# EAGLE design PhotodiodeSplitter2.0 (EAGLE 5.10)
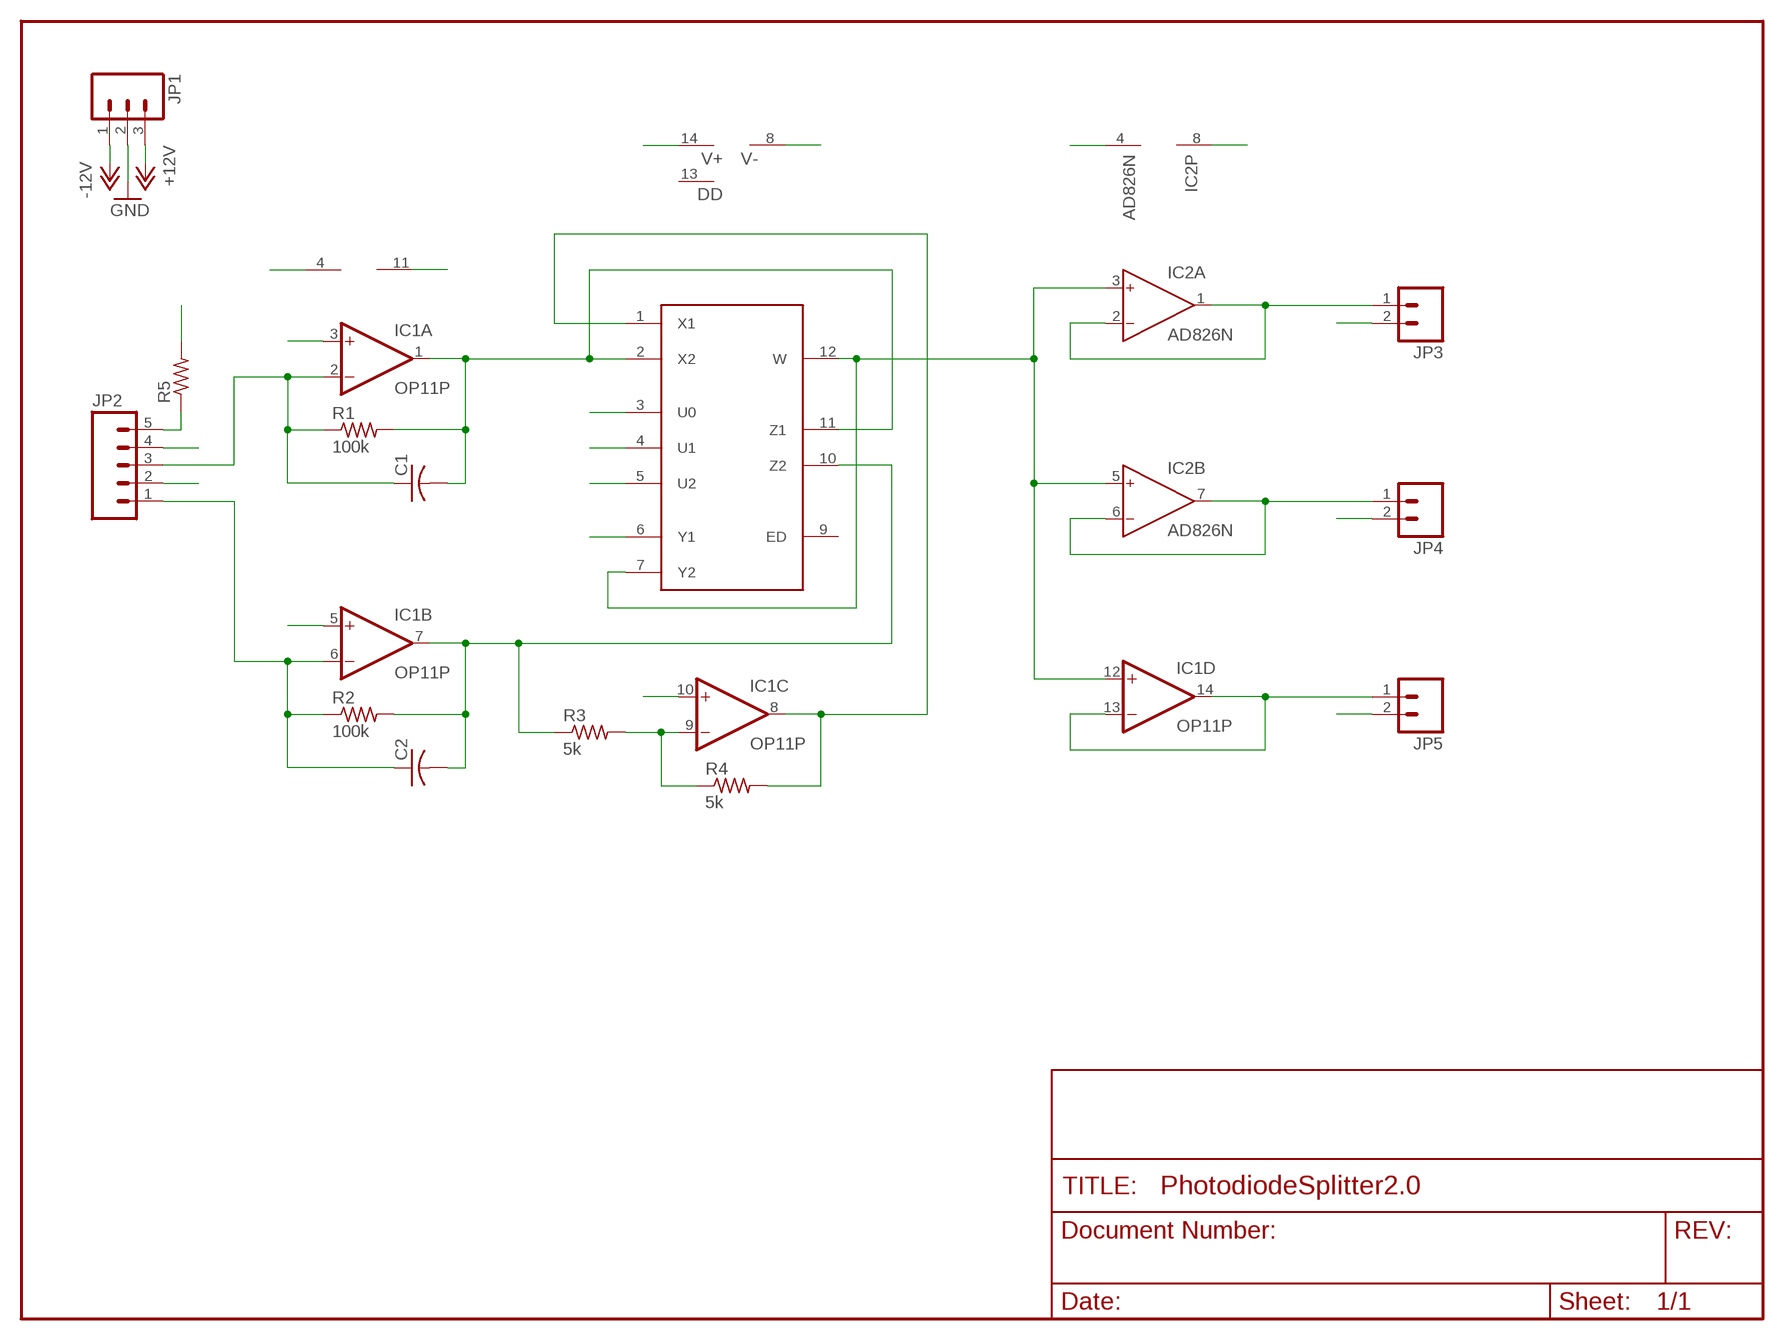
[diagram p0: schematic, sheet 1]

## Parts
C1  C-US050-025X075  [C050-025X075]
C2  C-US050-025X075  [C050-025X075]
IC1  OP11P  [DIL14]
IC2  AD826N  [DIL08]
JP1  M03PTH  [1X03]
JP2  M05PTH  [1X05]
JP3  M02PTH  [1X02]
JP4  M02PTH  [1X02]
JP5  M02PTH  [1X02]
MP1  AD734AQ  [DIL14]
R1  100k  R-US_0207/10  [0207/10]
R2  100k  R-US_0207/10  [0207/10]
R3  5k  R-US_0207/10  [0207/10]
R4  5k  R-US_0207/10  [0207/10]
R5  R-US_0309/12  [0309/12]

## Nets
+12V: IC1.4(P:V+) IC2.8(P:V+) JP1.3 MP1.14(V+) R5.2
-12V: IC1.11(P:V-) IC2.4(P:V-) JP1.1 MP1.8(V-)
GND: IC1.3(A:+IN) IC1.5(B:+IN) IC1.10(C:+IN) JP1.2 JP2.2 JP2.4 JP3.2 JP4.2 JP5.2 MP1.3(U0) MP1.4(U1) MP1.5(U2) MP1.6(Y1)
N$1: C1.1 IC1.2(A:-IN) JP2.3 R1.1
N$2: C1.2 IC1.1(A:OUT) MP1.2(X2) MP1.11(Z1) R1.2
N$3: C2.1 IC1.6(B:-IN) JP2.1 R2.1
N$4: C2.2 IC1.7(B:OUT) MP1.10(Z2) R2.2 R3.1
N$5: IC1.9(C:-IN) R3.2 R4.1
N$6: IC1.8(C:OUT) MP1.1(X1) R4.2
N$7: IC1.12(D:+IN) IC2.3(A:IN+) IC2.5(B:IN+) MP1.7(Y2) MP1.12(W)
N$8: IC2.1(A:OUT) IC2.2(A:IN-) JP3.1
N$9: IC2.6(B:IN-) IC2.7(B:OUT) JP4.1
N$10: IC1.13(D:-IN) IC1.14(D:OUT) JP5.1
N$11: JP2.5 R5.1
Unconnected: MP1.9(ED) MP1.13(DD)

## Library data of the parts
C1 C2 = resistor:C-US: CAPACITOR, American symbol
IC1 = linear:OP11: Quad Low-Offset Low-Power OP AMP The OP-11 is pin compatible with the OP-400 , LM148, HA4741, RM4156, and LT1014 operational amplifiers source http://products.analog.com/products/info.asp?product=OP400
IC2 = analog-devices:AD826: High-Speed, Low-Power Dual Operational Amplifier Source: http://www.analog.com/static/imported-files/data_sheets/AD826.pdf
JP1 = SparkFun:M03: Header 3 Standard 3-pin 0.1" header. Use with straight break away headers (SKU : PRT-00116), right angle break away headers (PRT-00553), swiss pins (PRT-00743), machine pins (PRT-00117), and female headers (PRT-00115). Molex polarized connector foot print use with SKU : PRT-08232 with associated crimp pins and housings.
JP2 = SparkFun:M05: Header 5 Standard 5-pin 0.1" header. Use with straight break away headers (SKU : PRT-00116), right angle break away headers (PRT-00553), swiss pins (PRT-00743), machine pins (PRT-00117), and female headers (PRT-00115). Molex polarized connector foot print use with SKU : PRT-08230 with associated crimp pins and housings.
JP3-JP5 = SparkFun:M02: Header 2 Standard 2-pin 0.1" header. Use with straight break away headers (SKU : PRT-00116), right angle break away headers (PRT-00553), swiss pins (PRT-00743), machine pins (PRT-00117), and female headers (PRT-00115). Molex polarized connector foot print use with SKU : PRT-08233 with associated crimp pins and housings.
MP1 = ad734:AD734*: 10 MHz, 4-Quadrant Multiplier/Divider FEATURES High Accuracy 0.1% Typical Error High Speed 10 MHz Full-Power Bandwidth 450 V/µs Slew Rate 200 ns Settling to 0.1% at Full Power Low Distortion -80 dBc from Any Input Third-Order IMD Typically -75 dBc at 10 MHz Low Noise 94 dB SNR, 10 Hz to 20 kHz 70 dB SNR, 10 Hz to 10 MHz Direct Division Mode 2 MHz BW at Gain of 100 APPLICATIONS High Performance Replacement for AD534 Multiply, Divide, Square, Square Root Modulator, Demodulator Wideband Gain Control, RMS-DC Conversion Voltage-Controlled Amplifiers, Oscillators, and Filters Demodulator with 40 MHz Input Bandwidth The AD734 is an accurate high speed, four-quadrant analog multiplier that is pin-compatible with the industry-standard AD534 and provides the transfer function W=XY/U. The AD734 provides a low-impedance voltage output with a fullpower (20V pk-pk) bandwidth of 10MHz. Total static error (scaling, offsets, and nonlinearities combined) is 0.1% of full scale. Distortion is typically less than -80dBc and guaranteed. The low capacitance X, Y and Z inputs are fully differential. In most applications, no external components are required to define the function.
R1-R5 = resistor:R-US_: RESISTOR, American symbol

## Board
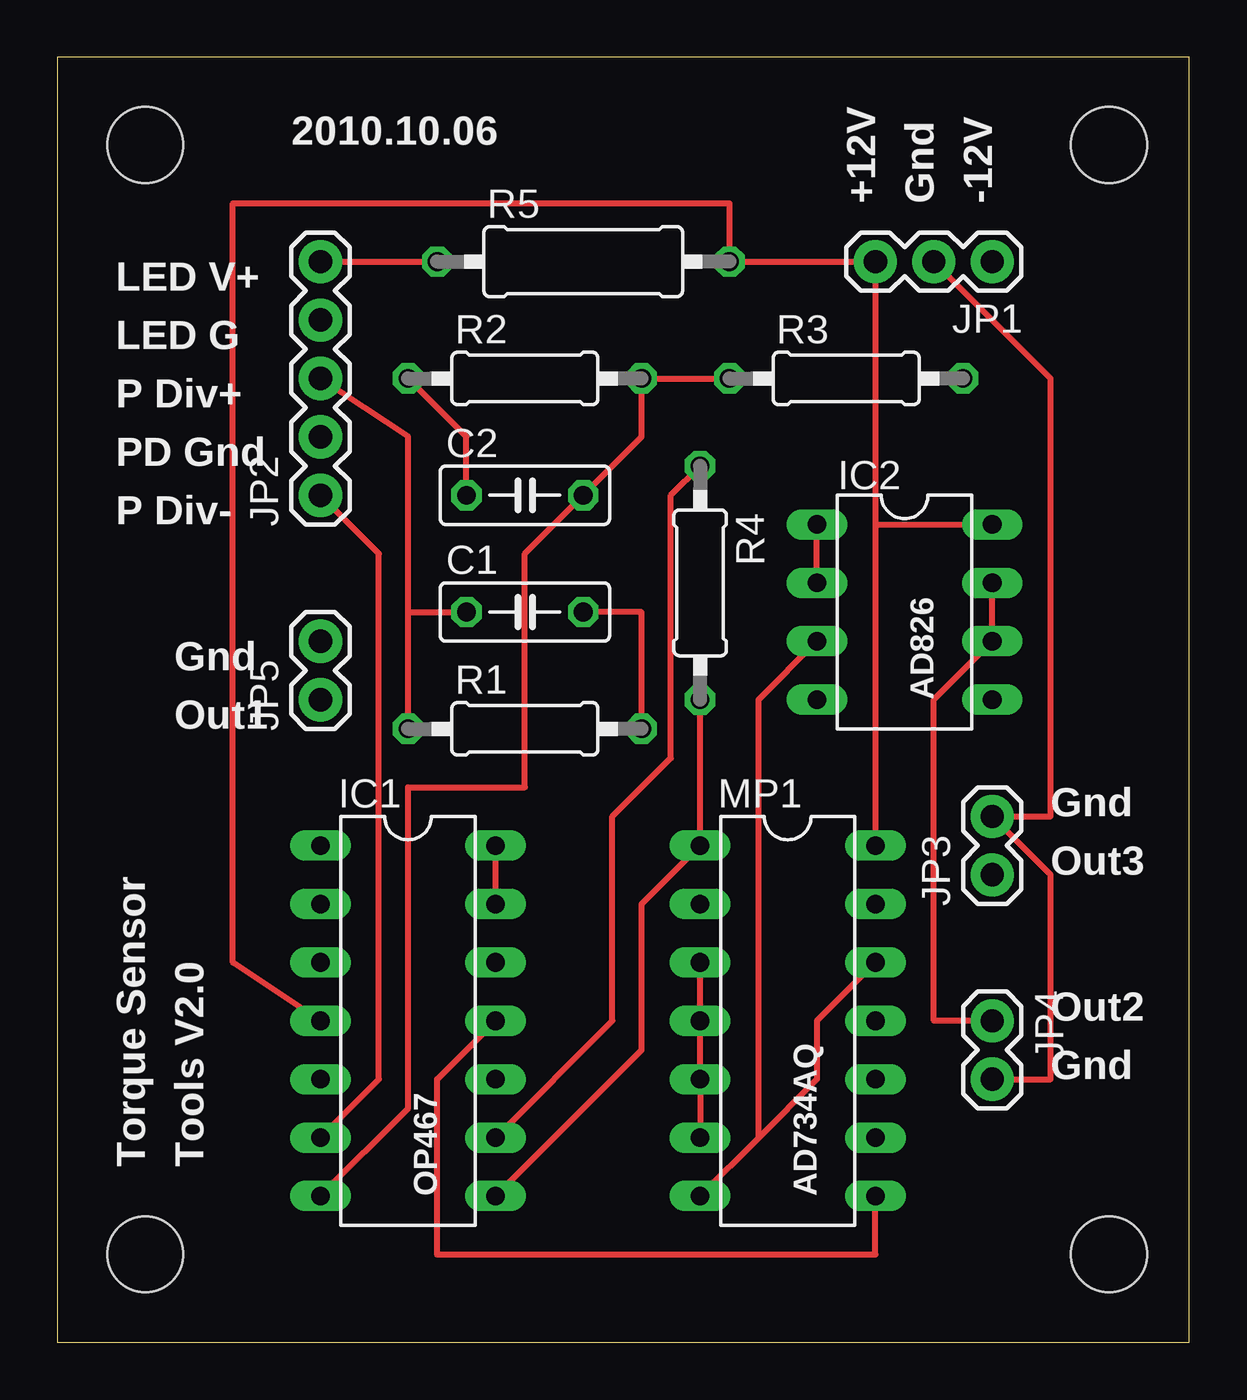
[diagram p1: board, top side]
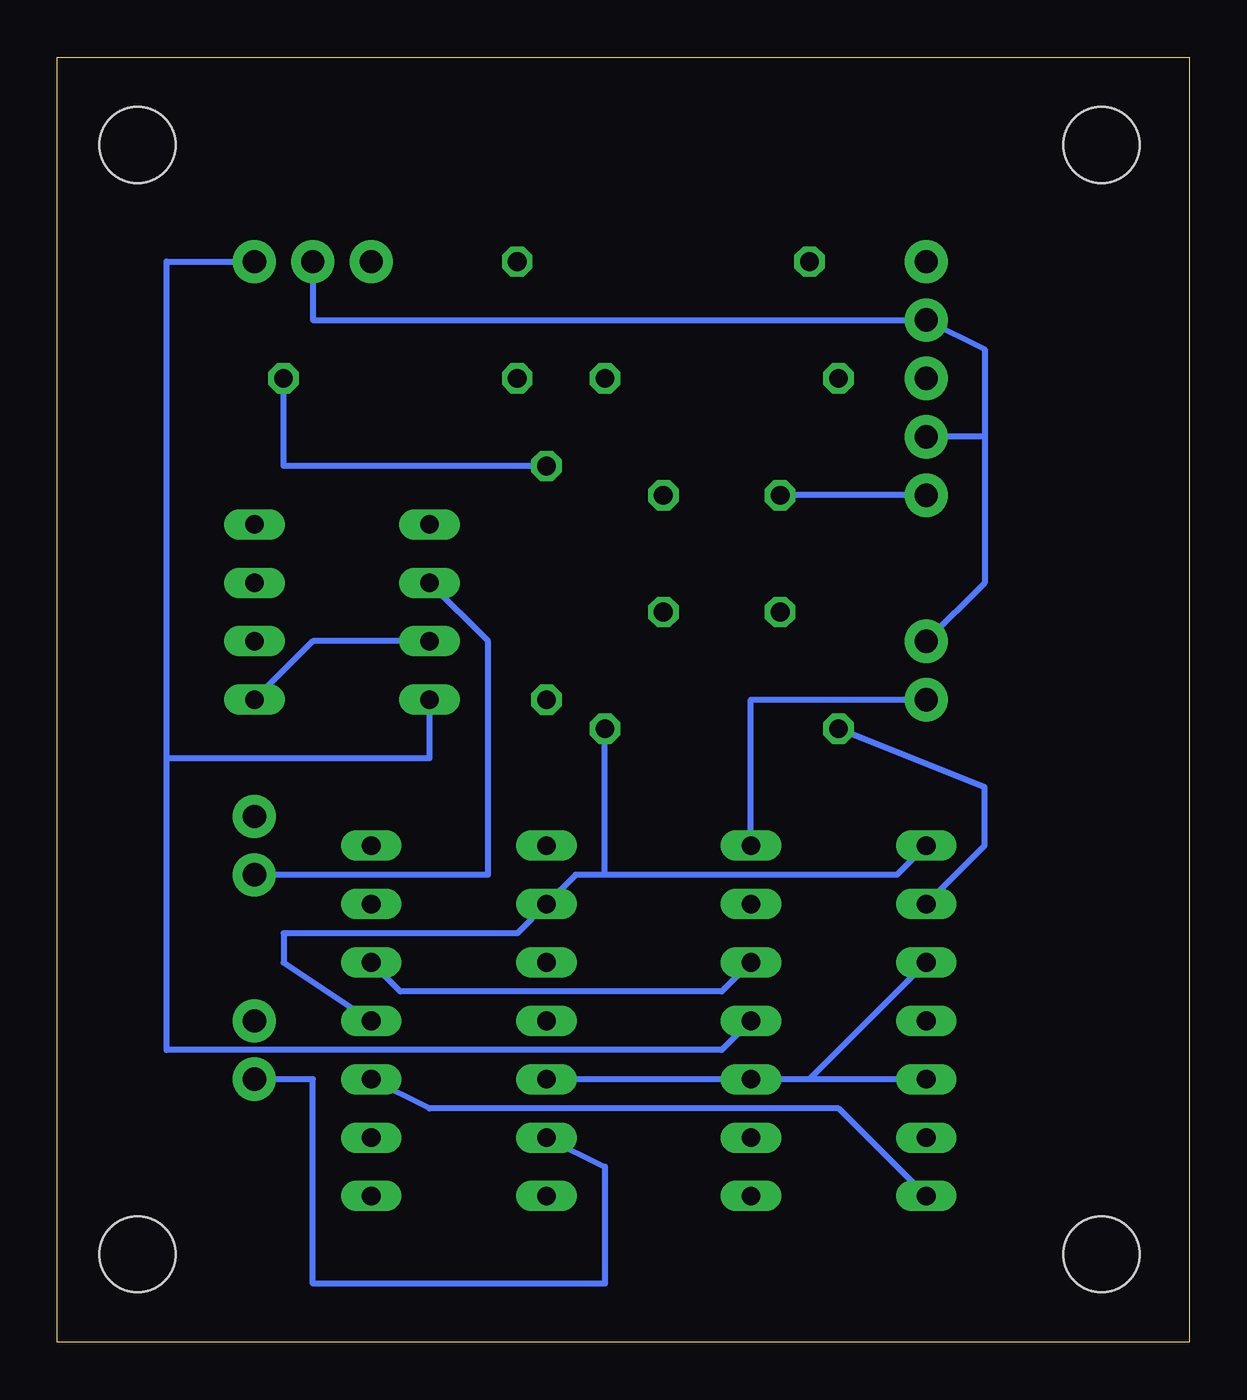
[diagram p2: board, bottom side, seen from below]

Size 49.2 x 55.87 mm. Coordinates in mm from the lower left corner, seen from the top.
Outline: 0,0 49.2,0 49.2,55.87 0,55.87 0,0
Copper layers (1*16): Top 0.035mm / dielectric 1.5mm / Bottom 0.035mm
Design rules "default": minimum track width 10mil, minimum drill 24mil, track to track 8mil, track to pad 8mil, pad to pad 8mil, via to via 8mil, smd to smd 8mil, copper to edge 40mil, drill to drill 8mil, minimum pad ring 10mil, minimum via ring 8mil, stop-mask expansion 4mil, vias tented up to drill 0mil, thermal gap 10mil

### Footprints (pad centres in the part's own frame; a part is rotated, then mirrored left to right if it is on the bottom)
C050-025X075 = drill 0.813 octagon: 1 -2.54,0; 2 2.54,0
DIL14 = drill 0.813 long: 1 -7.62,-3.81; 2 -5.08,-3.81; 3 -2.54,-3.81; 4 0,-3.81; 5 2.54,-3.81; 6 5.08,-3.81; 7 7.62,-3.81; 8 7.62,3.81; 9 5.08,3.81; 10 2.54,3.81; 11 0,3.81; 12 -2.54,3.81; 13 -5.08,3.81; 14 -7.62,3.81
DIL08 = drill 0.813 long: 1 -3.81,-3.81; 2 -1.27,-3.81; 3 1.27,-3.81; 4 3.81,-3.81; 5 3.81,3.81; 6 1.27,3.81; 7 -1.27,3.81; 8 -3.81,3.81
1X03 = drill 1.016 pad 1.88 round: 1 0,0; 2 2.54,0; 3 5.08,0
1X05 = drill 1.016 pad 1.88 round: 1 0,0; 2 2.54,0; 3 5.08,0; 4 7.62,0; 5 10.16,0
1X02 = drill 1.016 pad 1.88 round: 1 0,0; 2 2.54,0
0207/10 = drill 0.813 octagon: 1 -5.08,0; 2 5.08,0
0309/12 = drill 0.813 octagon: 1 -6.35,0; 2 6.35,0
STAND-OFF = hole 3.302: 0,0

### Placement (x,y rotation side)
C1  20.32,31.75 0 top
C2  20.32,36.83 0 top
IC1  15.24,13.97 270 top
IC2  36.83,31.75 270 top
JP1  40.64,46.99 180 top
JP2  11.43,36.83 90 top
JP3  40.64,20.32 90 top
JP4  40.64,13.97 270 top
JP5  11.43,27.94 90 top
MP1  31.75,13.97 270 top
R1  20.32,26.67 0 top
R2  20.32,41.91 0 top
R3  34.29,41.91 0 top
R4  27.94,33.02 270 top
R5  22.86,46.99 0 top
U$1  [STAND-OFF]  3.81,52.07 0 top
U$2  [STAND-OFF]  3.81,3.81 0 top
U$3  [STAND-OFF]  45.72,3.81 0 top
U$4  [STAND-OFF]  45.72,52.07 0 top

### Tracks (layer width: path | path; a pad name or v marks a point on that pad's centre or on a via)
+12V
  Top 0.254: 35.56,35.56 JP1.3 R5.2 29.21,49.53 7.62,49.53 7.62,16.51 IC1.4 | 35.56,35.56 MP1.14 | 35.56,35.56 IC2.8
-12V
  Top 0.254: IC1.11 16.51,11.43 16.51,3.81 35.56,3.81 MP1.8
  Bottom 0.254: IC2.4 33.02,25.4 44.45,25.4 | 44.45,25.4 44.45,46.99 JP1.1 | IC1.11 20.32,12.7 44.45,12.7 44.45,25.4
GND
  Top 0.254: JP4.2 43.18,11.43 43.18,20.32 JP3.2 43.18,22.86 43.18,41.91 JP1.2 | MP1.6 MP1.5 MP1.4 MP1.3
  Bottom 0.254: 16.51,11.43 IC1.10 MP1.5 | IC1.5 16.51,11.43 | 16.51,11.43 IC1.3 | JP4.2 38.1,11.43 38.1,2.54 25.4,2.54 25.4,7.62 MP1.6 | JP5.2 8.89,33.02 8.89,39.37 | 8.89,39.37 JP2.2 | 8.89,39.37 8.89,43.18 JP2.4 38.1,44.45 JP1.2
N$1
  Top 0.254: 15.24,31.75 C1.1 | R1.1 15.24,31.75 | JP2.3 15.24,39.37 15.24,31.75
  Bottom 0.254: IC1.2 8.89,21.59 8.89,24.13 R1.1
N$2
  Top 0.254: R1.2 25.4,31.75 C1.2
  Bottom 0.254: IC1.1 12.7,20.32 25.4,20.32 | 25.4,20.32 26.67,20.32 MP1.2 29.21,17.78 39.37,17.78 39.37,16.51 MP1.11 | 25.4,20.32 R1.2
N$3
  Top 0.254: R2.1 17.78,39.37 C2.1 | IC1.6 13.97,11.43 13.97,34.29 JP2.1
  Bottom 0.254: JP2.1 C2.1
N$4
  Top 0.254: R3.1 R2.2 25.4,39.37 C2.2 20.32,34.29 20.32,24.13 15.24,24.13 15.24,10.16 IC1.7
  Bottom 0.254: IC1.7 15.24,10.16 33.02,10.16 MP1.10
N$5
  Top 0.254: IC1.9 24.13,13.97 24.13,22.86 26.67,25.4 26.67,36.83 R4.1
  Bottom 0.254: R3.2 39.37,38.1 R4.1
N$6
  Top 0.254: IC1.8 25.4,12.7 25.4,19.05 MP1.1 R4.2
N$7
  Top 0.254: 30.48,8.89 33.02,11.43 33.02,13.97 MP1.12 | 30.48,8.89 MP1.7 | IC2.3 30.48,27.94 30.48,8.89
  Bottom 0.254: IC2.5 38.1,30.48 IC2.3 | IC1.12 20.32,15.24 34.29,15.24 MP1.12
N$8
  Top 0.254: IC2.2 IC2.1
  Bottom 0.254: IC2.2 30.48,30.48 30.48,20.32 JP3.1
N$9
  Top 0.254: IC2.7 IC2.6 38.1,27.94 38.1,13.97 JP4.1
N$10
  Top 0.254: IC1.13 IC1.14
  Bottom 0.254: IC1.14 19.05,27.94 JP5.1
N$11
  Top 0.254: JP2.5 R5.1

### Text on the board
tPlace: 2010.10.06 | +12V | Gnd | -12V | LED V+ | LED G | P Div+ | PD Gnd | P Div- | Gnd | AD826 | Out1 | Gnd | Out3 | Out2 | Gnd | Torque Sensor | Tools V2.0 | OP467 | AD734AQ